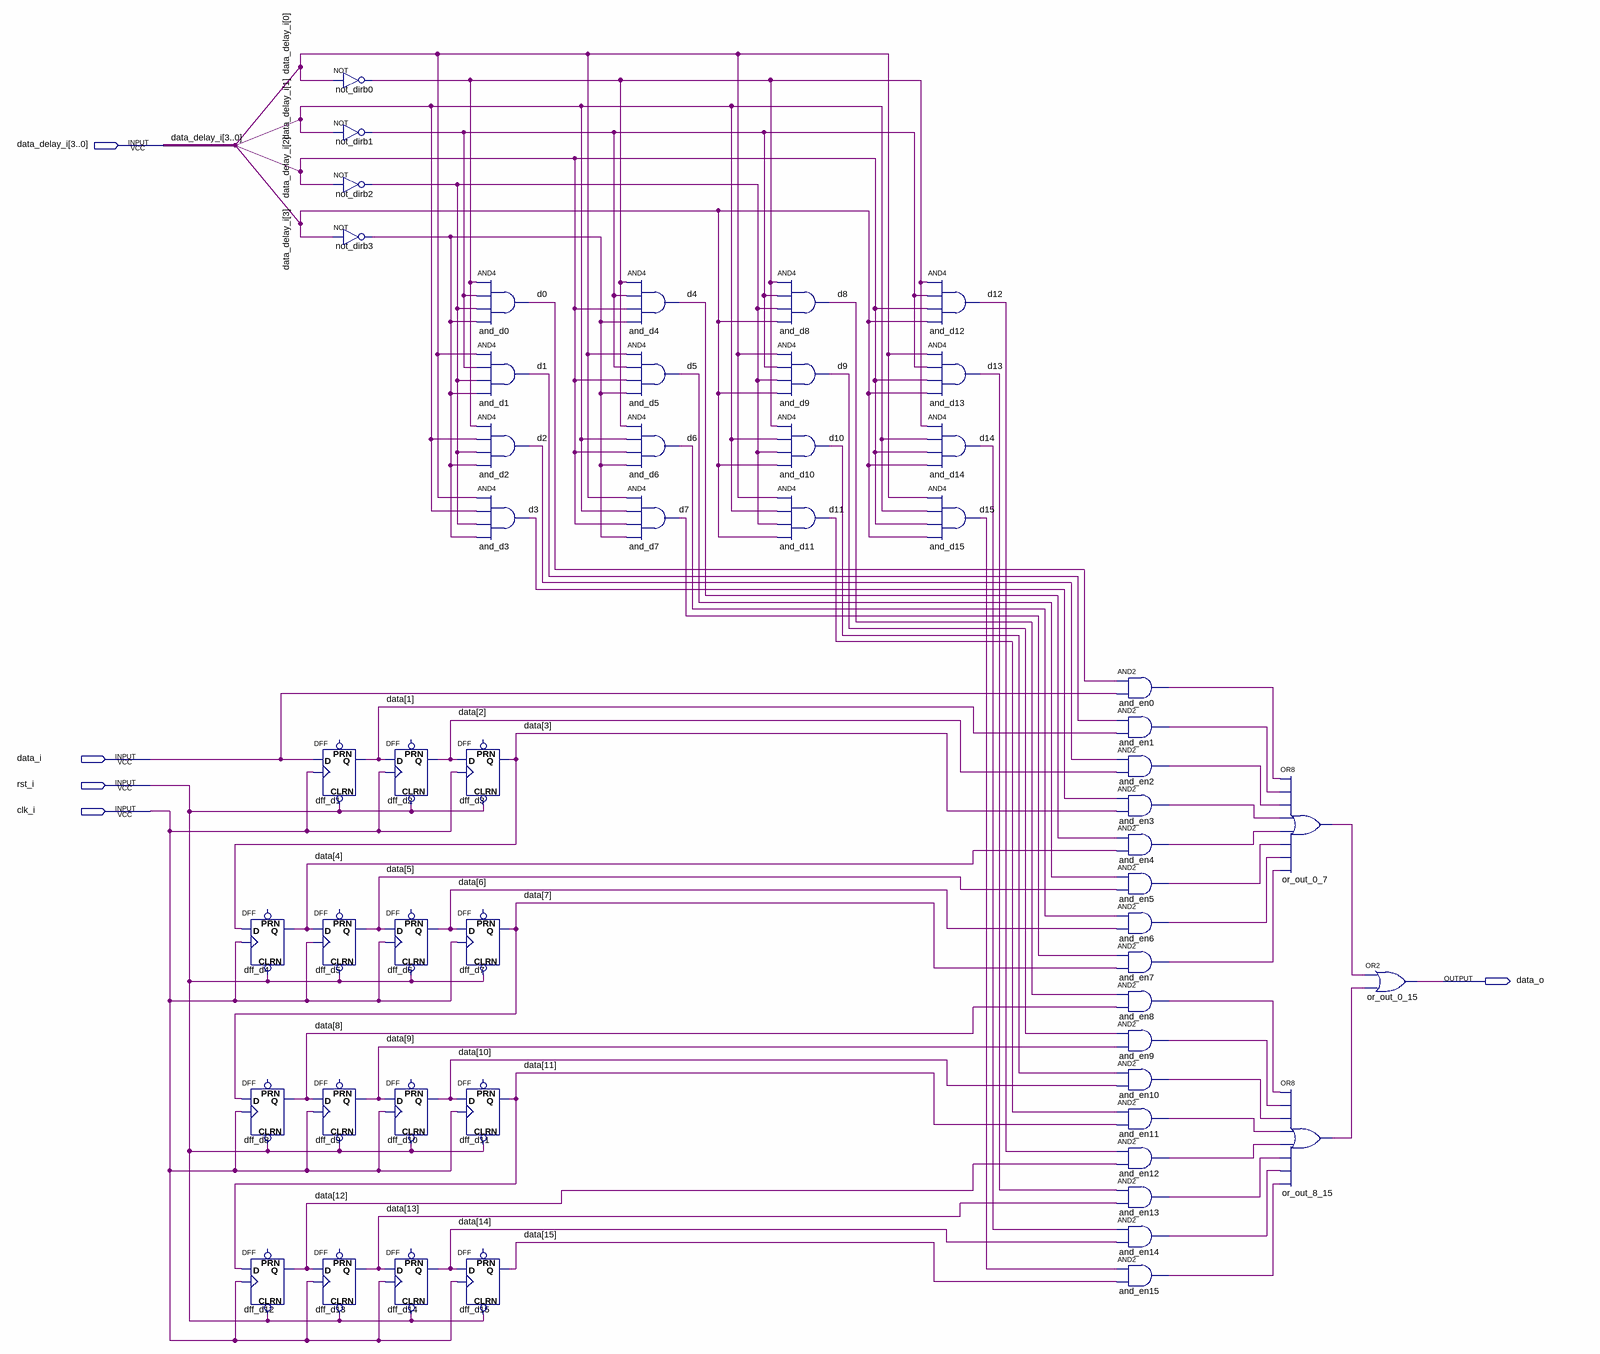
[diagram p0: schematic sheet]
// Quartus schematic delay_15.bdf as structural Verilog: 54 symbols, 5 pins
module delay_15 (
  input  [3:0] data_delay_i,
  input  data_i,
  input  rst_i,
  input  clk_i,
  output data_o
);

  wire and_en0_out, and_en1_out, and_en2_out, and_en3_out, and_en4_out, and_en5_out, and_en6_out,
       and_en7_out, and_en8_out, and_en9_out, and_en10_out, and_en11_out, and_en12_out, and_en13_out,
       and_en14_out, and_en15_out, d0, d1, d2, d3, d4, d5, d6, d7, d8, d9, d10, d11, d12, d13, d14, d15,
       not_dirb0_out, not_dirb1_out, not_dirb2_out, not_dirb3_out, or_out_0_7_out, or_out_8_15_out;
  wire [15:1] data;

  DFF dff_d4 (.CLRN(rst_i), .CLK(clk_i), .D(data[3]), .Q(data[4]));  // open: PRN
  DFF dff_d8 (.CLRN(rst_i), .CLK(clk_i), .D(data[7]), .Q(data[8]));  // open: PRN
  DFF dff_d12 (.CLRN(rst_i), .CLK(clk_i), .D(data[11]), .Q(data[12]));  // open: PRN
  not not_dirb0 (not_dirb0_out, data_delay_i[0]);
  not not_dirb1 (not_dirb1_out, data_delay_i[1]);
  not not_dirb2 (not_dirb2_out, data_delay_i[2]);
  not not_dirb3 (not_dirb3_out, data_delay_i[3]);
  DFF dff_d1 (.CLRN(rst_i), .CLK(clk_i), .D(data_i), .Q(data[1]));  // open: PRN
  DFF dff_d5 (.CLRN(rst_i), .CLK(clk_i), .D(data[4]), .Q(data[5]));  // open: PRN
  DFF dff_d9 (.CLRN(rst_i), .CLK(clk_i), .D(data[8]), .Q(data[9]));  // open: PRN
  DFF dff_d13 (.CLRN(rst_i), .CLK(clk_i), .D(data[12]), .Q(data[13]));  // open: PRN
  DFF dff_d2 (.CLRN(rst_i), .CLK(clk_i), .D(data[1]), .Q(data[2]));  // open: PRN
  DFF dff_d6 (.CLRN(rst_i), .CLK(clk_i), .D(data[5]), .Q(data[6]));  // open: PRN
  DFF dff_d10 (.CLRN(rst_i), .CLK(clk_i), .D(data[9]), .Q(data[10]));  // open: PRN
  DFF dff_d14 (.CLRN(rst_i), .CLK(clk_i), .D(data[13]), .Q(data[14]));  // open: PRN
  DFF dff_d3 (.CLRN(rst_i), .CLK(clk_i), .D(data[2]), .Q(data[3]));  // open: PRN
  DFF dff_d7 (.CLRN(rst_i), .CLK(clk_i), .D(data[6]), .Q(data[7]));  // open: PRN
  DFF dff_d11 (.CLRN(rst_i), .CLK(clk_i), .D(data[10]), .Q(data[11]));  // open: PRN
  DFF dff_d15 (.CLRN(rst_i), .CLK(clk_i), .D(data[14]), .Q(data[15]));  // open: PRN
  and and_d0 (d0, not_dirb0_out, not_dirb1_out, not_dirb2_out, not_dirb3_out);
  and and_d1 (d1, data_delay_i[0], not_dirb1_out, not_dirb2_out, not_dirb3_out);
  and and_d2 (d2, not_dirb0_out, data_delay_i[1], not_dirb2_out, not_dirb3_out);
  and and_d3 (d3, data_delay_i[0], data_delay_i[1], not_dirb2_out, not_dirb3_out);
  and and_d4 (d4, not_dirb0_out, not_dirb1_out, data_delay_i[2], not_dirb3_out);
  and and_d5 (d5, data_delay_i[0], not_dirb1_out, data_delay_i[2], not_dirb3_out);
  and and_d6 (d6, not_dirb0_out, data_delay_i[1], data_delay_i[2], not_dirb3_out);
  and and_d7 (d7, data_delay_i[0], data_delay_i[1], data_delay_i[2], not_dirb3_out);
  and and_d8 (d8, not_dirb0_out, not_dirb1_out, not_dirb2_out, data_delay_i[3]);
  and and_d9 (d9, data_delay_i[0], not_dirb1_out, not_dirb2_out, data_delay_i[3]);
  and and_d10 (d10, not_dirb0_out, data_delay_i[1], not_dirb2_out, data_delay_i[3]);
  and and_d11 (d11, data_delay_i[0], data_delay_i[1], not_dirb2_out, data_delay_i[3]);
  and and_d12 (d12, not_dirb0_out, not_dirb1_out, data_delay_i[2], data_delay_i[3]);
  and and_d13 (d13, data_delay_i[0], not_dirb1_out, data_delay_i[2], data_delay_i[3]);
  and and_d14 (d14, not_dirb0_out, data_delay_i[1], data_delay_i[2], data_delay_i[3]);
  and and_d15 (d15, data_delay_i[0], data_delay_i[1], data_delay_i[2], data_delay_i[3]);
  and and_en0 (and_en0_out, d0, data_i);
  and and_en1 (and_en1_out, d1, data[1]);
  and and_en2 (and_en2_out, d2, data[2]);
  and and_en3 (and_en3_out, d3, data[3]);
  and and_en4 (and_en4_out, d4, data[4]);
  and and_en5 (and_en5_out, d5, data[5]);
  and and_en6 (and_en6_out, d6, data[6]);
  and and_en7 (and_en7_out, d7, data[7]);
  and and_en8 (and_en8_out, d8, data[8]);
  and and_en9 (and_en9_out, d9, data[9]);
  and and_en10 (and_en10_out, d10, data[10]);
  and and_en11 (and_en11_out, d11, data[11]);
  and and_en12 (and_en12_out, d12, data[12]);
  and and_en13 (and_en13_out, d13, data[13]);
  and and_en14 (and_en14_out, d14, data[14]);
  and and_en15 (and_en15_out, d15, data[15]);
  or or_out_0_7 (or_out_0_7_out, and_en0_out, and_en1_out, and_en2_out, and_en3_out, and_en4_out, and_en5_out, and_en6_out, and_en7_out);
  or or_out_8_15 (or_out_8_15_out, and_en8_out, and_en9_out, and_en10_out, and_en11_out, and_en12_out, and_en13_out, and_en14_out, and_en15_out);
  or or_out_0_15 (data_o, or_out_0_7_out, or_out_8_15_out);
endmodule
